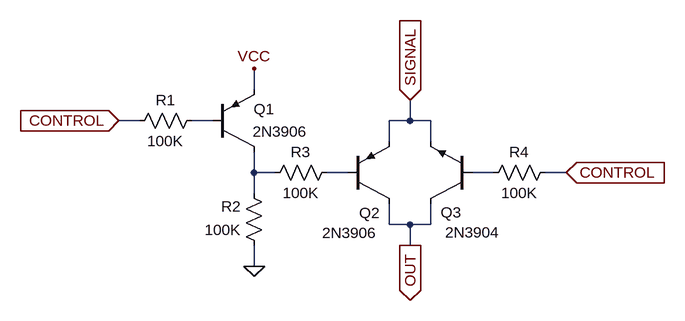
[diagram p0: schematic switch_on_3.3v.asc]
switch_on_3.3v.asc, the LTspice schematic file:
Version 4
SHEET 1 2264 680
WIRE 416 -304 416 -336
WIRE 240 -256 208 -256
WIRE 352 -256 320 -256
WIRE 656 -256 656 -288
WIRE 656 -256 624 -256
WIRE 688 -256 656 -256
WIRE 624 -224 624 -256
WIRE 688 -224 688 -256
WIRE 416 -176 416 -208
WIRE 448 -176 416 -176
WIRE 560 -176 528 -176
WIRE 784 -176 752 -176
WIRE 896 -176 864 -176
WIRE 416 -144 416 -176
WIRE 624 -96 624 -128
WIRE 656 -96 624 -96
WIRE 688 -96 688 -128
WIRE 688 -96 656 -96
WIRE 656 -64 656 -96
WIRE 416 -32 416 -64
FLAG 896 -176 CONTROL
IOPIN 896 -176 In
FLAG 656 -288 SIGNAL
IOPIN 656 -288 In
FLAG 416 -336 VCC
FLAG 416 -32 0
FLAG 208 -256 CONTROL
IOPIN 208 -256 In
FLAG 656 -64 OUT
IOPIN 656 -64 Out
SYMBOL npn 752 -128 R180
WINDOW 0 17 -13 Left 2
WINDOW 3 -43 -44 Left 2
SYMATTR InstName Q3
SYMATTR Value 2N3904
SYMBOL res 880 -192 R90
WINDOW 0 0 56 VBottom 2
WINDOW 3 32 56 VTop 2
SYMATTR InstName R4
SYMATTR Value 100K
SYMBOL pnp 560 -128 M180
WINDOW 0 18 -14 Left 2
WINDOW 3 -39 -45 Left 2
SYMATTR InstName Q2
SYMATTR Value 2N3906
SYMBOL res 432 -48 R180
WINDOW 0 36 76 Left 2
WINDOW 3 36 40 Left 2
SYMATTR InstName R2
SYMATTR Value 100K
SYMBOL res 336 -272 R90
WINDOW 0 0 56 VBottom 2
WINDOW 3 32 56 VTop 2
SYMATTR InstName R1
SYMATTR Value 100K
SYMBOL pnp 352 -208 M180
WINDOW 0 63 66 Left 2
WINDOW 3 62 31 Left 2
SYMATTR InstName Q1
SYMATTR Value 2N3906
SYMBOL res 544 -192 R90
WINDOW 0 0 56 VBottom 2
WINDOW 3 32 56 VTop 2
SYMATTR InstName R3
SYMATTR Value 100K

The netlist it stands for:
* switch_on_3.3v.asc
Q3 OUT N004 SIGNAL 0 2N3904
R4 CONTROL N004 100K
Q2 OUT N003 SIGNAL 0 2N3906
R2 0 N002 100K
R1 N001 CONTROL 100K
Q1 N002 N001 VCC 0 2N3906
R3 N003 N002 100K
.model NPN NPN
.model PNP PNP
.lib standard.bjt
.backanno
.end